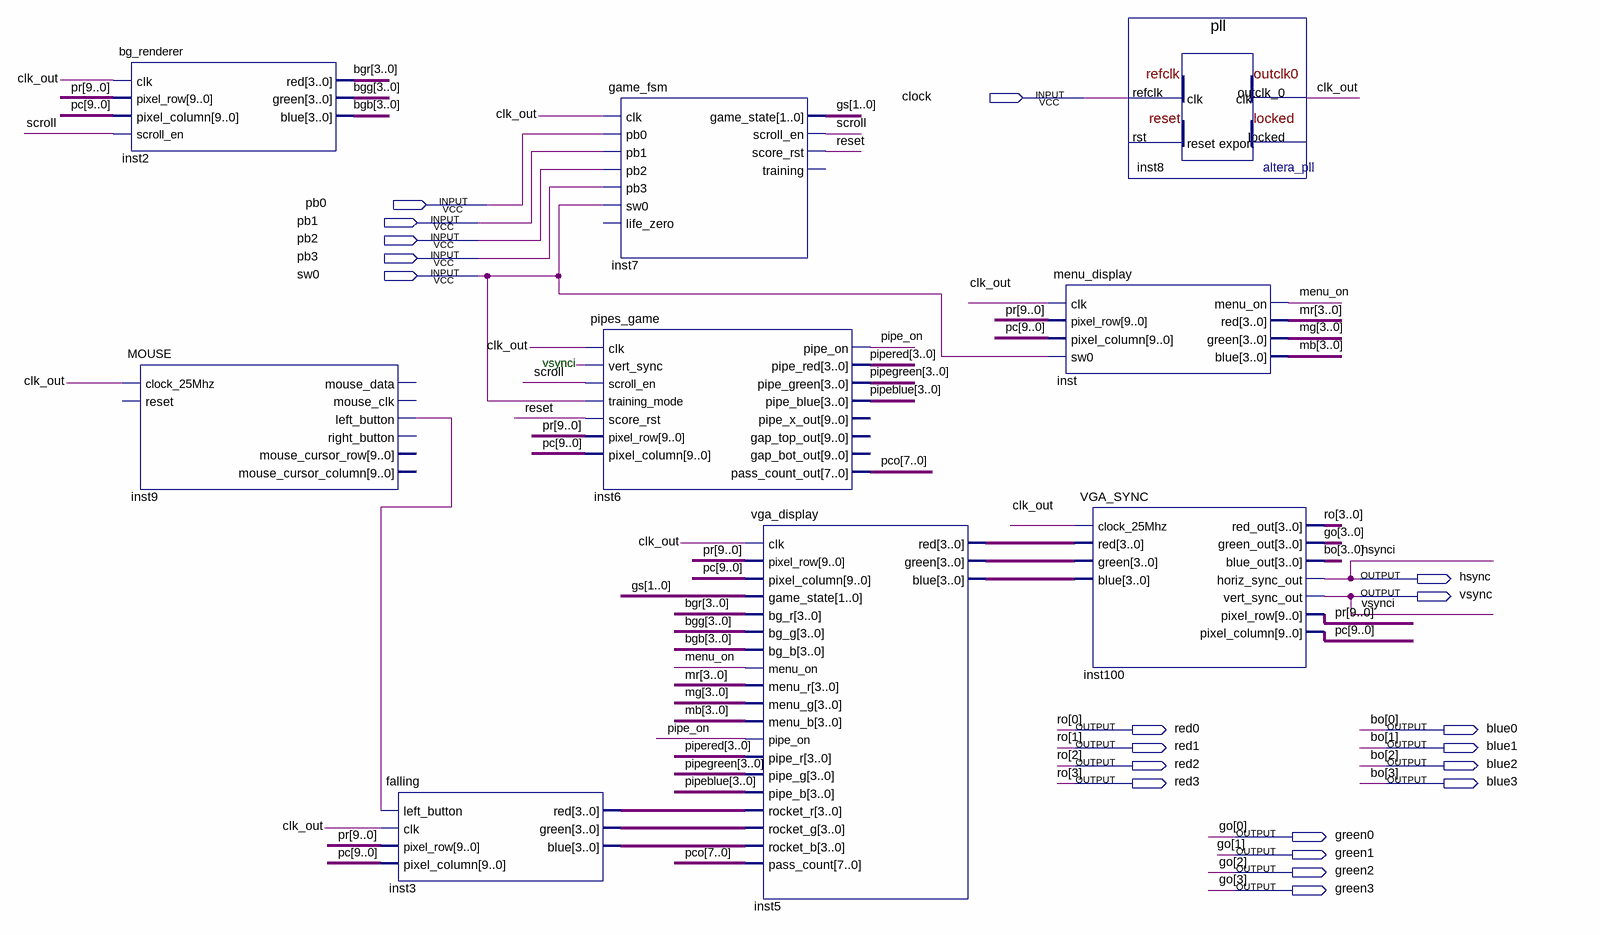
[diagram p0: schematic sheet]
// Quartus schematic ssss.bdf as structural Verilog: 9 symbols, 20 pins
module ssss (
  input  clock,
  input  pb0,
  input  pb1,
  input  pb2,
  input  pb3,
  input  sw0,
  output hsync,
  output vsync,
  output red0,
  output blue0,
  output red1,
  output blue1,
  output red2,
  output blue2,
  output red3,
  output blue3,
  output green0,
  output green1,
  output green2,
  output green3
);

  wire clk_out, inst9_left_button, menu_on, pipe_on, reset, scroll;
  wire [1:0] gs;
  wire [3:0] bgb, bgg, bgr, inst3_blue, inst3_green, inst3_red, inst5_blue, inst5_green, inst5_red, mb, mg,
       mr, pipeblue, pipegreen, pipered;
  wire [7:0] pco;
  wire [9:0] pc, pr;

  bg_renderer inst2 (
    .clk(clk_out), .pixel_row(pr), .pixel_column(pc), .scroll_en(scroll), .red(bgr), .green(bgg), .blue(bgb));
  MOUSE inst9 (
    .clock_25Mhz(clk_out), .left_button(inst9_left_button));  // open: reset, right_button, mouse_cursor_row, mouse_cursor_column, mouse_data, mouse_clk
  falling inst3 (
    .left_button(inst9_left_button), .clk(clk_out), .pixel_row(pr), .pixel_column(pc), .red(inst3_red),
    .green(inst3_green), .blue(inst3_blue));
  game_fsm inst7 (
    .clk(clk_out), .pb0(pb0), .pb1(pb1), .pb2(pb2), .pb3(pb3), .sw0(sw0), .game_state(gs),
    .scroll_en(scroll), .score_rst(reset));  // open: life_zero, training
  pipes_game inst6 (
    .clk(clk_out), .vert_sync(vsync), .scroll_en(scroll), .training_mode(sw0), .score_rst(reset),
    .pixel_row(pr), .pixel_column(pc), .pipe_on(pipe_on), .pipe_red(pipered), .pipe_green(pipegreen),
    .pipe_blue(pipeblue), .pass_count_out(pco));  // open: pipe_x_out, gap_top_out, gap_bot_out
  vga_display inst5 (
    .clk(clk_out), .pixel_row(pr), .pixel_column(pc), .game_state(gs), .bg_r(bgr), .bg_g(bgg), .bg_b(bgb),
    .menu_on(menu_on), .menu_r(mr), .menu_g(mg), .menu_b(mb), .pipe_on(pipe_on), .pipe_r(pipered),
    .pipe_g(pipegreen), .pipe_b(pipeblue), .rocket_r(inst3_red), .rocket_g(inst3_green),
    .rocket_b(inst3_blue), .pass_count(pco), .red(inst5_red), .green(inst5_green), .blue(inst5_blue));
  menu_display inst (
    .clk(clk_out), .pixel_row(pr), .pixel_column(pc), .sw0(sw0), .menu_on(menu_on), .red(mr), .green(mg),
    .blue(mb));
  VGA_SYNC inst100 (
    .clock_25Mhz(clk_out), .red(inst5_red), .green(inst5_green), .blue(inst5_blue),
    .red_out({red3, red2, red1, red0}), .green_out({green3, green2, green1, green0}),
    .blue_out({blue3, blue2, blue1, blue0}), .horiz_sync_out(hsync), .vert_sync_out(vsync), .pixel_row(pr),
    .pixel_column(pc));
  pll inst8 (.refclk(clock), .outclk_0(clk_out));  // open: rst, locked

  // Other names for the same wires on the sheet: bo[3:0] = {blue3, blue2, blue1, blue0};
  //   go[3:0] = {green3, green2, green1, green0}; hsynci = hsync; ro[3:0] = {red3, red2, red1, red0}; vsynci = vsync

  // Notes on the sheet:
  //   vsynci
endmodule
